# Altium schematic sheet MainBoard.SchDoc
size A4
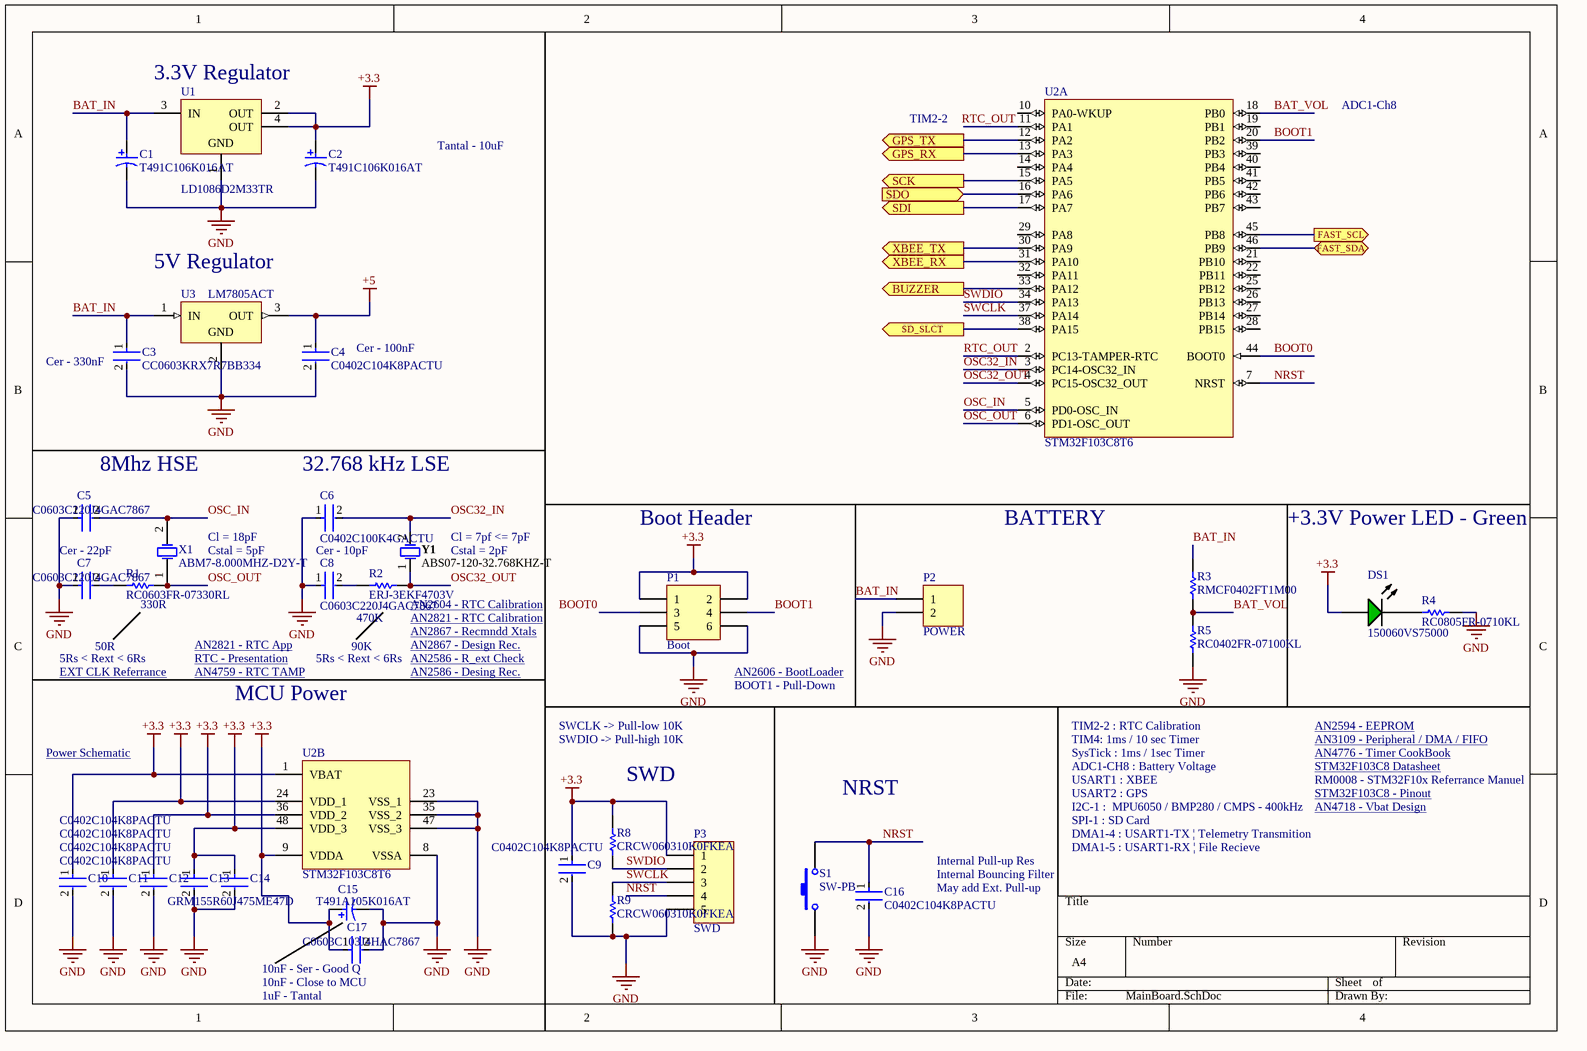
[diagram p0: MainBoard.SchDoc]

## Parts
C1  T491C106K016AT  [KEMT-T491-C_L]
C2  T491C106K016AT  [KEMT-T491-C_L]
C3  CC0603KRX7R7BB334  [FP-CC0603-DA-MFG]
C4  C0402C104K8PACTU  [FP-C0402-BB-MFG]
C5  C0603C220J4GAC7867  [FP-C0603C-CF-MFG]
C6  C0402C100K4GACTU  [FP-C0402-BB-MFG]
C7  C0603C220J4GAC7867  [FP-C0603C-CF-MFG]
C8  C0603C220J4GAC7867  [FP-C0603C-CF-MFG]
C9  C0402C104K8PACTU  [FP-C0402-BB-MFG]
C10  C0402C104K8PACTU  [FP-C0402-BB-MFG]
C11  C0402C104K8PACTU  [FP-C0402-BB-MFG]
C12  C0402C104K8PACTU  [FP-C0402-BB-MFG]
C13  GRM155R60J475ME47D  [FP-GRM155-0_1-IPC_B]
C14  C0402C104K8PACTU  [FP-C0402-BB-MFG]
C15  T491A105K016AT  [KEMT-T491A105K016AT_L]
C16  C0402C104K8PACTU  [FP-C0402-BB-MFG]
C17  C0603C103J4HAC7867  [FP-C0603C-CF-MFG]
DS1  150060VS75000  [WE-150060VS75000_V]
P1  Boot  [HDR2X3]
P2  POWER  [HDR1X2H]
P3  SWD  [HDR1X5]
R1  RC0603FR-07330RL  [RESC1608X55X25NL10T15]
R2  ERJ-3EKF4703V  [RESC1608X55X30LL15T15]
R3  RMCF0402FT1M00  [RESC1005X40X25LL10T15]
R4  RC0805FR-0710KL  [RESC2013X60X35NL10T20]
R5  RC0402FR-07100KL  [RESC1005X40X25NL05T10]
R8  CRCW060310K0FKEA  [RESC1609X50X30NL8T20]
R9  CRCW060310K0FKEA  [RESC1609X50X30NL8T20]
S1  SW-PB  [SPST-2]
U1  LD1086D2M33TR  [D2PAK_A_L]
U2  STM32F103C8T6  [STM-LQFP48_L]  (parts A,B of 2)
U3  LM7805ACT  [FAIR-TO-220-3]
X1  ABM7-8.000MHZ-D2Y-T  [ABRA-ABM7-2_V]
Y1  ABS07-120-32.768KHZ-T  [ABRA-ABS07_A_V]

## Ports
BUZZER (out), FAST_SCL (out), FAST_SDA (bidir), GPS_RX (out), GPS_TX (out), SCK (out), SD_SLCT (out), SDI (out), SDO (in), XBEE_RX (out), XBEE_TX (out)

## Nets
+3.3: C2.1 C9.1 C10.1 C11.1 C12.1 C13.1 C14.1 C15.1 C17.1 DS1.2(A) P1.1 P1.2 P3.1 R8.2 U1.2(OUT) U1.4(OUT) U2.1(VBAT) U2.9(VDDA) U2.24(VDD_1) U2.36(VDD_2) U2.48(VDD_3)
+5: C4.1 U3.3(OUT)
GND: C1.2 C2.2 C3.2 C4.2 C5.1 C6.1 C7.1 C8.1 C9.2 C10.2 C11.2 C12.2 C13.2 C14.2 C15.2 C16.2 C17.2 P1.5 P1.6 P2.2 P3.5 R4.2 R5.1 R9.1 S1.1 U1.1(GND) U2.8(VSSA) U2.23(VSS_1) U2.35(VSS_2) U2.47(VSS_3) U3.2(GND)
BAT_IN: C1.1 C3.1 P2.1 R3.2 U1.3(IN) U3.1(IN)
BAT_VOL: R3.1 R5.2 U2.18(PB0)
BOOT0: P1.3 U2.44(BOOT0)
BOOT1: P1.4 U2.20(PB2)
BUZZER: U2.33(PA12) ; port BUZZER
FAST_SCL: U2.45(PB8) ; port FAST_SCL
FAST_SDA: U2.46(PB9) ; port FAST_SDA
GPS_RX: U2.13(PA3) ; port GPS_RX
GPS_TX: U2.12(PA2) ; port GPS_TX
NRST: C16.1 P3.4 S1.2 U2.7(NRST)
OSC32_IN: C6.2 U2.3(PC14-OSC32_IN) Y1.2
OSC32_OUT: R2.2 U2.4(PC15-OSC32_OUT) Y1.1
OSC_IN: C5.2 U2.5(PD0-OSC_IN) X1.2(X2)
OSC_OUT: R1.2 U2.6(PD1-OSC_OUT) X1.1(X1)
RTC_OUT: U2.2(PC13-TAMPER-RTC) U2.11(PA1)
SCK: U2.15(PA5) ; port SCK
SD_SLCT: U2.38(PA15) ; port SD_SLCT
SDI: U2.17(PA7) ; port SDI
SDO: U2.16(PA6) ; port SDO
SWCLK: P3.3 R9.2 U2.37(PA14)
SWDIO: P3.2 R8.1 U2.34(PA13)
XBEE_RX: U2.31(PA10) ; port XBEE_RX
XBEE_TX: U2.30(PA9) ; port XBEE_TX
NetC7_2: C7.2 R1.1
NetC8_2: C8.2 R2.1
NetDS1_1: DS1.1(K) R4.1

Not connected (* = marked no-connect by the designer): U2 10(PA0-WKUP) 14(PA4) 19(PB1) 21(PB10) 22(PB11) 25(PB12) 26(PB13) 27(PB14) 28(PB15) 29(PA8) 32(PA11) 39(PB3) 40(PB4) 41(PB5) 42(PB6) 43(PB7)

## Notes on the sheet
- (near U1) 3.3V Regulator
- ADC1-Ch8
- Tantal - 10uF
- TIM2-2
- (near U3) 5V Regulator
- (near C3) Cer - 330nF
- (near C4) Cer - 100nF
- (near C5) 8Mhz HSE
- (near C6) 32.768 kHz LSE
- Cer - 22pF
- Cl = 18pF
- Cstal = 5pF
- Cer - 10pF
- (near Y1) Cl = 7pf <= 7pF
- Cstal = 2pF
- Boot Header
- BATTERY
- +3.3V Power LED - Green
- 50R
- (near R1) 330R
- AN2821 - RTC App <https://www.st.com/resource/en/application_note/cd00207941-clockcalendar-implementation-on-the-stm32f10xxx-microcontroller-rtc-stmicroelectronics.pdf>
- 90K
- 470K
- AN2867 - Recmndd Xtals <https://www.st.com/resource/en/application_note/cd00221665-oscillator-design-guide-for-stm8afals-stm32-mcus-and-mpus-stmicroelectronics.pdf#page=26>
- AN2867 - Design Rec. <https://www.st.com/resource/en/application_note/cd00221665-oscillator-design-guide-for-stm8afals-stm32-mcus-and-mpus-stmicroelectronics.pdf#page=42>
- (near R2) AN2821 - RTC Calibration <https://www.st.com/resource/en/application_note/cd00207941-clockcalendar-implementation-on-the-stm32f10xxx-microcontroller-rtc-stmicroelectronics.pdf#page=11>
- (near R2) AN2604 - RTC Calibration <https://www.st.com/resource/en/application_note/cd00167326-stm32f101xx-and-stm32f103xx-rtc-calibration-stmicroelectronics.pdf>
- EXT CLK Referrance <https://www.st.com/resource/en/datasheet/stm32f103c8.pdf#page=53>
- 5Rs < Rext < 6Rs
- AN4759 - RTC TAMP <https://www.st.com/resource/en/application_note/dm00226326-using-the-hardware-realtime-clock-rtc-and-the-tamper-management-unit-tamp-with-stm32-microcontrollers-stmicroelectronics.pdf>
- RTC - Presentation <https://www.st.com/content/ccc/resource/training/technical/product_training/group0/44/60/e0/b2/ee/f4/47/ff/STM32F7_WDG_TIMERS_RTC/files/STM32F7_WDG_TIMERS_RTC.pdf/jcr:content/translations/en.STM32F7_WDG_TIMERS_RTC.pdf>
- MCU Power
- AN2586 - R_ext Check <https://www.st.com/resource/en/application_note/cd00164185-getting-started-with-stm32f10xxx-hardware-development-stmicroelectronics.pdf#page=11>
- AN2586 - Desing Rec. <https://www.st.com/resource/en/application_note/cd00164185-getting-started-with-stm32f10xxx-hardware-development-stmicroelectronics.pdf#page=20>
- (near P1) AN2606 - BootLoader <https://www.st.com/resource/en/application_note/cd00167594-stm32-microcontroller-system-memory-boot-mode-stmicroelectronics.pdf>
- BOOT1 - Pull-Down
- Power Schematic <https://www.st.com/resource/en/datasheet/stm32f103c8.pdf#page=36>
- SWCLK -> Pull-low 10K
- SWDIO -> Pull-high 10K
- (near R8) SWD
- TIM2-2 : RTC Calibration
- SysTick : 1ms / 1sec Timer
- ADC1-CH8 : Battery Voltage
- USART1 : XBEE
- TIM4: 1ms / 10 sec Timer
- AN4776 - Timer CookBook <https://www.st.com/resource/en/application_note/dm00236305-generalpurpose-timer-cookbook-for-stm32-microcontrollers-stmicroelectronics.pdf>
- AN2594 - EEPROM <https://www.st.com/resource/en/application_note/cd00165693-eeprom-emulation-in-stm32f10x-microcontrollers-stmicroelectronics.pdf>
- AN3109 - Peripheral / DMA / FIFO <https://www.st.com/resource/en/application_note/cd00256689-communication-peripheral-fifo-emulation-with-dma-and-dma-timeout-in-stm32f10x-microcontrollers-stmicroelectronics.pdf>
- STM32F103C8 Datasheet <https://www.st.com/resource/en/datasheet/stm32f103c8.pdf>
- RM0008 - STM32F10x Referrance Manuel
- NRST
- USART2 : GPS
- I2C-1 :  MPU6050 / BMP280 / CMPS - 400kHz
- SPI-1 : SD Card
- DMA1-4 : USART1-TX | Telemetry Transmition
- DMA1-5 : USART1-RX | File Recieve
- STM32F103C8 - Pinout <https://image.easyeda.com/avatars/2019/3/KmHKEtCdfBwJxhMzcaLVH8TwX4AiZKtbc56eBVjd.jpeg>
- AN4718 - Vbat Design <https://www.st.com/resource/en/application_note/dm00206898-how-to-design-a-vbat-system-based-on-stm32l0l1-series-with-external-components-stmicroelectronics.pdf>
- Internal Pull-up Res
- Internal Bouncing Filter
- May add Ext. Pull-up
- (near C17) 10nF - Ser - Good Q
- (near C17) 10nF - Close to MCU
- (near C17) 1uF - Tantal

## Library data of the parts
C1 C2 = CMP-2000-07197-1: Tantalum Capacitor, 10 uF, +/- 10%, 16 V, -55 to 125 degC, 2-Pin SMD (T491-C), RoHS, Tape and Reel; Manufacturer: Kemet; Product Diameter (mm): NotRequiredmm; Product Depth (mm): 3.2mm; ESR: 1.8ohm; Product Length (mm): 6mm; DCL: 1.6uA; Seal: NotRequired; Voltage: 16VDC; DF: 6%; Product Height (mm): 2.5mm; Polarity: Polar; Rad Hardened: No; Case Style: Molded; Capacitance: 10000000pF; Datasheet URL: http://capacitoredge.kemet.com/capedge2/DataSheet/Datasheet-T491C106K016AT.pdf?pn=T491C106K016AT; Datasheet Version: 10/2016; Packaging: TapeandReel; Tolerance (+ or -): 10%; Mounting Technology: SurfaceMount; Package Description: 2-Pin Surface Mount Device, Body 6 x 3.2 mm; Manufacturer URL: http://www.kemet.com/; Length W/Weld (max): NotRequiredmm; Lead Spacing (nom): NotRequiredmm; Operating Temp Range: -55Cto125C; Package Reference: T491-C; Mounting Style: SurfaceMount; Length W/Weld: NotRequiredmm; Failure Rate: NotRequired; Wire Form: NotRequired; Package / Case: 6032-28; Insulation: NotRequired; Construction: SMTChip; Seated Plane Height: NotRequiredmm; Case Code: C
C3 = CMP-03422-000838-1: CAP CER 0.33UF 16V X7R 0603; Manufacturer: YAGEO; VALUE: 330 nF; Material: Ceramic; Tolerance: 0.1; Temperature Coefficient: 15%; Package: CC0603-DA; Footprint Url: http://www.yageo.com/exep/pages/download/literatures/UPY-C_GEN_24.pdf; Lead Free: Yes; Temperature: -55°C to +125°C; RoHS: TRUE; Temperature Range High: +125°C; Mouser Description: Multilayer Ceramic Capacitors MLCC - SMD/SMT 330nF 16V X7R 10%; Category: Cap; Temperature Characteristic: X7R; Octopart: https://octopart.com/cc0603krx7r7bb334-yageo-9291796; Voltage: 16 V; Device Class L1: Passive Components; Capacitance: 330 nF; ComponentLink2URL: http://www.yageo.com/documents/recent/UPY-GPHC_X7R_6.3V-to-50V_18.pdf; Temperature Range Low: -55°C; Digikey Description: CAP CER 0.33UF 16V X7R 0603; Manufacturer Part Number: CC0603KRX7R7BB334; Device Class L2: Capacitors; Voltage Rating: 16 V; Device Class L3: Ceramic Capacitors; ComponentLink2Description: Datasheet; Height: 0.9mm; Automotive: No
C4 C11 C12 = CMP-2008-02046-2: CAP CER 0.1UF 10V X5R 0402; Manufacturer: Kemet; Material: Ceramic; Capacitance: 0.10 μF; Temperature Coefficient: 15%; Tolerance: 0.1; VALUE: 0.10 µF; Package: C0402-BB; Temperature: -55°C to +125°C; ComponentLink2Description: Datasheet; Temperature Characteristic: X5R; Device Class L1: Passive Components; Height: 0.55mm; Lead Free: Yes; ComponentLink2URL: https://content.kemet.com/datasheets/KEM_C1002_X7R_SMD.pdf; Device Class L2: Capacitors; Temperature Range Low: -55°C; Temperature Range High: +125°C; RoHS: TRUE; Octopart: https://octopart.com/c0402c104k8pactu-kemet-140039; Automotive: No; Mouser Description: Capacitor 100 nF 10 VDC 0402; Category: Cap; Voltage Rating: 10 V; Digikey Description: CAP CER 0.1UF 10V X5R 0402; Ipc Land Pattern Name: CAPC10050X50; Device Class L3: Ceramic Capacitors; Manufacturer Part Number: C0402C104K8PACTU
C5 C7 C8 = CMP-03020-006720-1: CAP CER 22PF 16V NP0 0603; Manufacturer: KEMET; Tolerance: 0.05; Temperature Characteristic: C0G; Material: Ceramic; Automotive Grade: Grade 1; Temperature Coefficient: 30ppm/°C; Octopart: https://octopart.com/c0603c220j4gac7867-kemet-1963820; Height: 0.87mm; Temperature Range High: +125°C; Manufacturer Part Number: C0603C220J4GAC7867; Category: Cap; Device Class L2: Capacitors; Automotive: Yes; Temperature: -55°C to +125°C; ComponentLink2Description: Datasheet; Capacitance: 22 pF; RoHS: TRUE; ComponentLink2URL: https://api.kemet.com/component-edge/download/datasheet/C0603C100J5GACAUTO.pdf; Lead Free: Yes; Package: C0603C-CF; Value: 22 pF; Device Class L3: Ceramic Capacitors; Device Class L1: Passive Components; Digikey Description: CAP CER 22PF 16V NP0 0603; Voltage Rating: 16 V; Temperature Range Low: -55°C
C6 = CMP-2008-03443-2: CAP CER 10PF 16V 10% NP0 0402; Manufacturer: Kemet; Material: Ceramic; Temperature Characteristic: C0G; Temperature Coefficient: 15%; Tolerance: 0.1; Device Class L2: Capacitors; Temperature Range High: +125°C; Device Class L3: Ceramic Capacitors; Height: 0.55mm; Mouser Description: Multilayer Ceramic Capacitors MLCC - SMD/SMT 16volts 10pF C0G 10%; Temperature Range Low: -55°C; Digikey Description: CAP CER 10PF 16V 10% NP0 0402; Device Class L1: Passive Components; ComponentLink2URL: https://content.kemet.com/datasheets/KEM_C1002_X7R_SMD.pdf; Package: C0402-BB; Automotive: No; Manufacturer Part Number: C0402C100K4GACTU; Ipc Land Pattern Name: CAPC10050X50; Voltage Rating: 16 V; Category: Cap; Lead Free: Yes; RoHS: TRUE; Temperature: -55°C to +125°C; Capacitance: 10 pF; Value: 10 pF; ComponentLink2Description: Datasheet; Octopart: https://octopart.com/c0402c100k4gactu-kemet-12569135
C9 C10 C14 C16 = CMP-2008-02046-2: CAP CER 0.1UF 10V X5R 0402; Manufacturer: Kemet; Material: Ceramic; Capacitance: 0.10 μF; Temperature Coefficient: 15%; Tolerance: 0.1; Value: 0.10 μF; Package: C0402-BB; Temperature: -55°C to +125°C; ComponentLink2Description: Datasheet; Temperature Characteristic: X5R; Device Class L1: Passive Components; Height: 0.55mm; Lead Free: Yes; ComponentLink2URL: https://content.kemet.com/datasheets/KEM_C1002_X7R_SMD.pdf; Device Class L2: Capacitors; Temperature Range Low: -55°C; Temperature Range High: +125°C; RoHS: TRUE; Octopart: https://octopart.com/c0402c104k8pactu-kemet-140039; Automotive: No; Mouser Description: Capacitor 100 nF 10 VDC 0402; Category: Cap; Voltage Rating: 10 V; Digikey Description: CAP CER 0.1UF 10V X5R 0402; Ipc Land Pattern Name: CAPC10050X50; Device Class L3: Ceramic Capacitors; Manufacturer Part Number: C0402C104K8PACTU
C13 = CMP-2008-04549-2: Chip Multilayer Ceramic Capacitors for General Purpose, 0402, 4.7uF, X5R, 15%, 20%, 6.3V; Height: 0.5mm; Weight: 0.000212oz; Length: 1mm; Case Code (Metric): 1005; Packaging: Tape and Reel; Termination: SMD/SMT; Dielectric: X5R; Depth: 0.5mm; Case Code (Imperial): 0402; Min Operating Temperature: -55°C; Case/Package: 0402; Voltage: 6.3V; Width: 0.02inch; Capacitance: 4.7uF; Lead Free: Lead Free; Thickness: 0.022inch; Contact Plating: Tin; REACH SVHC: No SVHC; Package Quantity: 10000; Tolerance: 20%; Voltage Rating (DC): 6.3V; Voltage Rating: 6.3V; Mount: Surface Mount; Max Operating Temperature: 85°C
C15 = CMP-2000-07186-1: Tantalun Capacitor, 1 uF, +/- 10%, 16 V, -55 to 125 degC, 2-Pin SMD, RoHS, Tape and Reel; Manufacturer: Kemet; Manufacturer Size Code: A; Type: Molded; Online Catalog: T491Series; Lifetime @ Temp.: 2000Hrs@85°C; Catalog Drawings: T49x,T5xxSeries_A-side1T49x,T5xxSeries_A,B-side2T49x,T5xxSeries_A,SBottom; Other Names: 399-3678-6; EDA / CAD Models: DownloadfromAcceleratedDesigns; Capacitance: 1.0µF; ESR (Equivalent Series Resistance): 10Ohm; Voltage - Rated: 16V; Product Training Modules: CapacitorBasics-TypicalUsesforCapacitorsDeratingGuidelinesforSurfaceMountTantalumCapacitors; Category: Capacitors; Lead Spacing: -; Package Description: 2-Pin Surface Mounted Device, Body 3.2 x 1.6 mm; Height - Seated (Max): 0.071"(1.80mm); Mounting Technology: SurfaceMount; Mounting Type: SurfaceMount; Standard Package: 1; Tolerance: ±10%; Datasheet Version: 06/2016; Manufacturer URL: http://www.kemet.com/; Packaging: Digi-Reel®; Family: TantalumCapacitors; Series: T491; Size / Dimension: 0.126"Lx0.063"W(3.20mmx1.60mm); Package / Case: 1206(3216Metric); Datasheet URL: http://capacitoredge.kemet.com/capedge2/DataSheet/Datasheet-T491A105K016AT.pdf?pn=T491A105K016AT; Operating Temperature: -55°C~125°C; Package Reference: 1206; Features: GeneralPurpose
C17 = CMP-03020-017806-1: CAP CER 0603 10NF 16V ULTRA STAB; Manufacturer: KEMET; Value: 10,000 pF; Material: Ceramic; Tolerance: 0.05; Temperature Coefficient: 30ppm/°C; Temperature Characteristic: X8R; Automotive Grade: Grade 1; Digikey Description: CAP CER 0603 10NF 16V ULTRA STAB; RoHS: TRUE; Manufacturer Part Number: C0603C103J4HAC7867; Temperature Range High: +125°C; Voltage Rating: 16 V; Device Class L3: Ceramic Capacitors; Device Class L1: Passive Components; Lead Free: Yes; Temperature Range Low: -55°C; ComponentLink2URL: https://api.kemet.com/component-edge/download/datasheet/C0603C100J5GACAUTO.pdf; Category: Cap; Capacitance: 10,000 pF; Octopart: https://octopart.com/c0603c103j4hac7867-kemet-88083778; ComponentLink2Description: Datasheet; Temperature: -55°C to +125°C; Device Class L2: Capacitors; Height: 0.87mm; Package: C0603C-CF; Automotive: Yes
DS1 = CMP-1426-00006-4: WL-SMCW SMD Chip LED Top View Monocolor Waterclear, 30 mA, 2 V, -40 to 85 degC, 2-Pin SMD, RoHS, Tape and Reel; DatasheetVersion: Rev. 2.7; PackageDescription: 2-Pin Surface Mount Device, Body 1.6 x 0.8 mm; ComponentLink1URL: https://www.we-online.com/; PartNumber: 150060VS75000; RoHSCompliant: True; ComponentLink2URL: http://katalog.we-online.de/led/datasheet/150060VS75000.pdf; ComponentLink1Description: Manufacturer URL; Mounting Technology: Surface Mount; ComponentLink2Description: Datasheet
P1 = Header 3X2: Header, 3-Pin, Dual row; LatestRevisionDate: 17-Jul-2002; LatestRevisionNote: Re-released for DXP Platform.; Publisher: Altium Limited
P2 = Header 2H: Header, 2-Pin, Right Angle; LatestRevisionDate: 17-Jul-2002; LatestRevisionNote: Re-released for DXP Platform.; Publisher: Altium Limited
P3 = Header 5: Header, 5-Pin; LatestRevisionDate: 17-Jul-2002; LatestRevisionNote: Re-released for DXP Platform.; Publisher: Altium Limited
R1 = CMP-1659-00020-2: Chip Resistor, 330 Ohm, +/- 1%, 0.1 W, -55 to 155 degC, 0603 (1608 Metric), RoHS, Tape and Reel; Tolerance: 10%; ESR: 800 mohm; Voltage Rating (DC): 16 V; Capacitance: 47 uF; Length: 7.3 mm; ComponentLink1URL: http://www.yageo.com/; Packaging: Tape and Reel; Pins: 2; ComponentLink1Description: Manufacturer URL; Case Code (Imperial): 2917; REACH SVHC: No SVHC; Width: 4.3 mm; ComponentLink2Description: Datasheet; Voltage Rating: 16 V; RoHSCompliant: True; Max Operating Temperature: 125degC; ComponentLink2URL: http://www.yageo.com/documents/recent/PYu-RC_Group_51_RoHS_L_04.pdf; Min Operating Temperature: -55degC; Case/Package: 2917; Radiation Hardening: No; DatasheetVersion: Rev. 4, 02/2016; Mount: Surface Mount; PackageReference: 0603; Package Quantity: 500; Case Code (Metric): 7343; PackageDescription: 2-Pin Surface Mount Device, Body 1.6 x 0.8 mm; Height: 3.1 mm
R2 = CMP-2000-00524-2: Chip Resistor, 470 KOhm, +/- 1%, 0.1 W, -55 to 155 degC, 0603 (1608 Metric), RoHS, Tape and Reel; Access Time: 7 ns; Max Supply Voltage: 3.6 V; Nominal Supply Current: 15 mA; Nominal Supply Voltage: 1.8 V; Case\Package: SOIC; Interface: SPI; Clock Frequency: 85 MHz; Min Supply Voltage: 1.65 V; Max Clock Frequency: 70 MHz; Density: 4 mb; DatasheetVersion: Apr-15; Min Operating Temperature: -40 degC; RoHSCompliant: true; Package Quantity: 98; REACH SVHC: Unknown; Max Operating Temperature: 85 degC; Packaging: Rail/Tube; ComponentLink2URL: http://industrial.panasonic.com/cdbs/www-data/pdf/RDA0000/AOA0000C86.pdf; PackageReference: 0603; Pins: 8; PackageDescription: 2-Pin Surface Mount Device, Body 1.6 x 0.85 mm; ComponentLink2Description: Datasheet; ComponentLink1Description: Manufacturer URL; ComponentLink1URL: http://www.panasonic.com/; Radiation Hardening: No; Mount: Surface Mount
R3 = CMP-2000-06985-1: Chip Resistor, 1 MOhm, +/- 1%, 63 mW, -55 to 155 degC, 0402 (1005 Metric), RoHS, Tape and Reel; Manufacturer: Stackpole-Electronics-Inc.; Temperature Coefficient: ±100ppm/°C; Power (Watts): 0.063W,1/16W; Resistance (Ohms): 1M; Height: 0.016"(0.40mm); Operating Temperature: -55°C~155°C; Number of Terminations: 2; Features: AutomotiveAEC-Q200; Datasheet Version: 01/2017; Package Reference: 0402; Mounting Technology: SurfaceMount; Category: Resistors; Datasheet URL: https://www.seielect.com/Catalog/SEI-RMCF_RMCP.pdf; Family: ChipResistor-SurfaceMount; Series: RMCF; Size / Dimension: 0.039"Lx0.020"W(1.00mmx0.50mm); Supplier Device Package: 0402; Package / Case: 0402(1005Metric); Composition: ThickFilm; Package Description: 2-Pin Surface Mount Device, Body 1 x 0.5 mm; Packaging: CutTape(CT); Tolerance: ±1%; Manufacturer URL: https://www.seielect.com/
R4 = CMP-1659-00013-4: Chip Resistor, 10 KOhm, +/- 1%, 0.125 W, -55 to 155 degC, 0805 (2012 Metric), RoHS, Tape and Reel; Manufacturer: Yageo; Voltage Rating: 150 V; Mount: Surface Mount; ComponentLink1Description: Manufacturer URL; ComponentLink2URL: http://www.yageo.com/documents/recent/PYu-RC_Group_51_RoHS_L_04.pdf; Pins: 2; Length: 2 mm; Min Operating Temperature: -55 degC; Height: 0.5 mm; Mounting Technology: Surface Mount; RoHSCompliant: true; REACH SVHC: No SVHC; ComponentLink1URL: http://www.yageo.com/; Max Operating Temperature: 155 degC; PackageReference: 0805; DatasheetVersion: Rev. 4, 02/2016; Package Quantity: 5000; Packaging: Tape and Reel; ComponentLink2Description: Datasheet; PackageDescription: 2-Pin Surface Mounted Device, Body 2 x 1.25 mm
R5 = CMP-2002-07343-1: Manufacturer: Yageo / Phycomp; Part Number: RC0402FR-07100KL
R8 R9 = CMP-1666-00005-4: Chip Resistor, 10 KOhm, +/- 1%, 100 mW, -55 to 155 degC, 0603 (1608 Metric), RoHS, Tape and Reel; Manufacturer: Vishay Semiconductor; Voltage Rating: 75 V; Max Operating Temperature: 155 degC; PackageDescription: 2-Pin Surface Mount Device, Body 1.575 x 0.85 mm; ComponentLink1Description: Manufacturer URL; RoHSCompliant: true; PackageReference: 0603; REACH SVHC: Unknown; Length: 1.55 mm; DatasheetVersion: 06/2012; Packaging: Tape and Reel; Min Operating Temperature: -55 degC; Mounting Technology: Surface Mount; ComponentLink2URL: https://datasheet.ciiva.com/11809/0900766b80d98afc-11809037.pdf; Height: 0.45 mm; ComponentLink2Description: Datasheet; Package Quantity: 5000; ComponentLink1URL: http://www.vishay.com/
S1 = SW-PB: Switch; Published: 24-Mar-1999; LatestRevisionDate: 17-Jul-2002; LatestRevisionNote: Re-released for DXP Platform.; PackageReference: SPST-2; Publisher: Altium Limited; PackageDescription: Switch; 2 Leads
U1 = CMP-0244-00505-1: 1.5A, Low Drop Positive Voltage Regulator, 3.3V, 4-Pin D2PAK/A, Tape and Reel; PackageDescription: 4-Pin Transistor Outline Package 2.54 mm Pitch, 15.4 mm Lead Span; DatasheetVersion: 11/07/2011; PackageReference: D2PAK_A; ComponentLink1Description: Manufacturer URL; ComponentLink2Description: Datasheet; PackageVersion: 2011; ComponentLink2URL: http://www.st.com/internet/com/TECHNICAL_RESOURCES/TECHNICAL_LITERATURE/DATASHEET/CD00001884.pdf; ComponentLink1URL: http://www.st.com
U2 = CMP-0237-00215-3: ARM Cortex-M3 32-bit MCU, 64 KB Flash, 20 KB Internal RAM, 37 I/Os, 48-pin LQFP, -40 to 85 degC, Tray; Supply Voltage(Vcc) min (V): 2; Internal RAM Size (kB): 20; FLASH Size (Prog) (kB): 64; A/D Converter: 2x12-bit (10 Channel); I/Os (High Current): 37; Operating Frequency(F) (Processor speed) (MHz): 72; Core: ARM Cortex-M3; ComponentLink3Description: Package Specification; Mounting Technology: Surface Mount; PartNumber: STM32F103C8T6; PackageReference: LQFP48; Packing: Tray; ComponentLink3URL: http://www.st.com/st-web-ui/static/active/en/resource/technical/document/datasheet/DM00058181.pdf; DatasheetVersion: Rev. 16; ComponentLink1URL: http://www.st.com/web/en/home.html; PackageVersion: Rev. 6, 06/2013; ComponentLink2URL: http://www.st.com/st-web-ui/static/active/en/resource/technical/document/datasheet/CD00161566.pdf; ComponentLink1Description: Manufacturer URL; ComponentLink2Description: Datasheet; PackageDescription: 48-Pin Low Profile Quad Flat Package, 7 x 7 mm Body, 0.5 mm Pitch
U3 = CMP-2000-04937-1: Positive Voltage Regulator, 5 V, 1 A, 0 to 125 degC, 3-Pin TO-220, RoHS, Tube; Manufacturer: Fairchild; Number of Outputs: 1; Typical Dropout Voltage @ Current: 2V@1A; Output Type: Fixed; Output Voltage: 5V; Quiescent Current: 6mA; Dropout Voltage Measurement Current: 1A; Line Regulation: 50mV; Maximum Input Voltage: 35V; Regulator Function: Linear; Load Regulation: 100mV; Package Type: TO-220; Mounting Type: ThroughHole; Height: 16.51mm; Maximum Operating Temperature: +125degC; Datasheet Version: Rev. 1.0.1, 05/2006; Package Reference: TO-220; Minimum Operating Temperature: 0degC; Manufacturer URL: https://www.fairchildsemi.com/; Package URL: https://www.fairchildsemi.com/package-drawings/TO/TO220B03.pdf; Length: 10.67mm; Series: LM78xx; Dimensions: 10.67x4.83x16.51mm; Polarity: Positive; Maximum Output Current: 1A; Pin Count: 3; Width: 4.83mm; Package Description: 3-Pin Through Hole Device, Body 10 x 4.5 mm, Pitch 2.54 mm; Datasheet URL: https://datasheet.ciiva.com/5816/1359194-5816420.pdf
X1 = CMP-2000-05034-1: Microprocessor Crystal, 8 MHz, 18 PF, -40 to 85 degC, 2-Pin SMD, RoHS, Tape and Reel; Manufacturer: Abracon; Online Catalog: ABM7Series; Load Capacitance: 18pF; Frequency Stability: ±30ppm; ESR (Equivalent Series Resistance): 100Ohm; Frequency: 8MHz; Operating Mode: Fundamental; 3D Model: ABM7.pdf / ABM7.stp; Catalog Drawings: ABM7SeriesTop / ABM7SeriesSide / ABM7SeriesBottom; Other Names: 535-9831-2 / ABM7-8.000MHZ-D-2-Y-T / ABM78000MHZD2YT; Frequency Tolerance: ±20ppm; Featured Product: ABM7andABM11Crystals; Category: CrystalsandOscillators; Operating Temperature: -40degC~85degC; Datasheet URL: https://datasheet.ciiva.com/1357/1718755-1357277.pdf; Packaging: Tape&Reel(TR); Package Reference: ABM7; Type: MHzCrystal; Datasheet Version: Dec-17; Package Description: 2-Pin Surface Mount Device, Body 6 x 3.5 mm; RoHS Information: RoHS2/REACHCompliance; Height: 0.055"(1.40mm); Family: Crystals; Standard Package: 1,000; Size / Dimension: 0.236"Lx0.138"W(6.00mmx3.50mm); Manufacturer URL: http://www.abracon.com/; Mounting Type: SurfaceMount; Series: ABM7; Package / Case: 2-SMD
Y1 = CMP-2000-07587-1: Tuning Fork Crystal, 32.768 KHz, +/- 20 ppm, -40 to 85 degC, 2-Pin SMD, RoHS, Tape and Reel; Manufacturer: Abracon; Case\/Package: SMD/SMT; Series Resistance: 60KOhm; Frequency Tolerance: 20ppm; Load Capacitance: 6pF; ESR (Equivalent Series Resistance): 55KOhm; Max Operating Temperature: 85degC; Width: 0.061inch; Radiation Hardening: No; Lead Free: LeadFree; RoHSCompliant: True; Depth: 1.5mm; Datasheet URL: http://www.abracon.com/Resonators/ABS07-120-32.768kHz-T.pdf; Frequency: 32.768KHz; Termination: SMD/SMT; Manufacturer URL: http://www.abracon.com/; Package Quantity: 3000; Packaging: TapeandReel; Number of Pins: 2; Height: 0.035inch; Package Description: 2-Pin Surface Mount Device, Body 3.2 x 1.5 mm; Package Reference: ABS07; Mount: SurfaceMount; Tolerance: 20ppm; Mounting Technology: SurfaceMount; REACH SVHC: NoSVHC; Datasheet Version: 11/2014; Length: 3.2mm; Min Operating Temperature: -40degC